# Altium schematic sheet CanFaults.SchDoc
size Letter; Organization: Altium Limited; Address1: L3, 12a Rodborough Rd; Address2: Frenchs Forest; Address3: NSW; Address4: Australia 2086; DocumentNumber: D_3; SheetNumber: 3; SheetTotal: 21
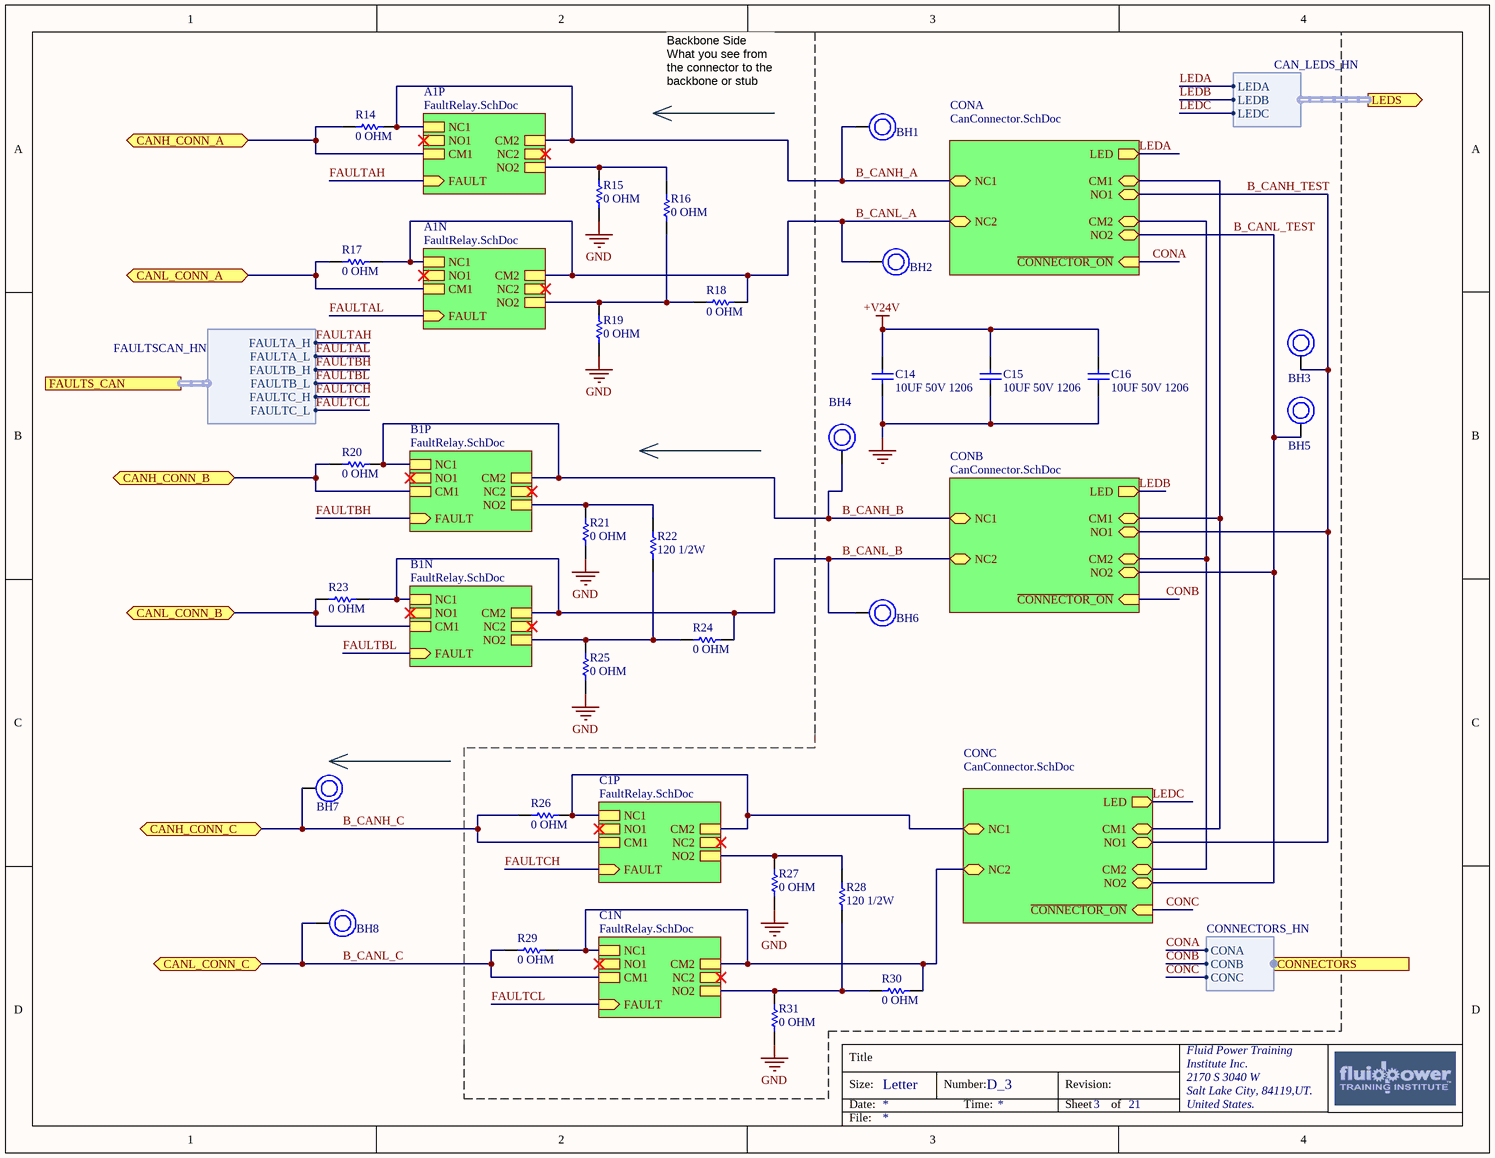
[diagram p0: CanFaults.SchDoc]

## Parts
BH1  BananaHole  [BananaHole]  (value not drawn)  (no BOM)
BH2  BananaHole  [BananaHole]  (value not drawn)  (no BOM)
BH3  BananaHole  [BananaHole]  (value not drawn)  (no BOM)
BH4  BananaHole  [BananaHole]  (value not drawn)  (no BOM)
BH5  BananaHole  [BananaHole]  (value not drawn)  (no BOM)
BH6  BananaHole  [BananaHole]  (value not drawn)  (no BOM)
BH7  BananaHole  [BananaHole]  (value not drawn)  (no BOM)
BH8  BananaHole  [BananaHole]  (value not drawn)  (no BOM)
C14  10UF 50V 1206  [CAPC3216X180X20ML20]
C15  10UF 50V 1206  [CAPC3216X180X20ML20]
C16  10UF 50V 1206  [CAPC3216X180X20ML20]
R14  0 OHM  [R0805]
R15  0 OHM  [R0805]
R16  0 OHM  [R0805]
R17  0 OHM  [R0805]
R18  0 OHM  [R0805]
R19  0 OHM  [R0805]
R20  0 OHM  [R0805]
R21  0 OHM  [R0805]
R22  120 1/2W  [RESC3225X60X45NL20T20]
R23  0 OHM  [R0805]
R24  0 OHM  [R0805]
R25  0 OHM  [R0805]
R26  0 OHM  [R0805]
R27  0 OHM  [R0805]
R28  120 1/2W  [RESC3225X60X45NL20T20]
R29  0 OHM  [R0805]
R30  0 OHM  [R0805]
R31  0 OHM  [R0805]

## Sub-sheets
A1N = FaultRelay.SchDoc: NC2, NO1, NC1, FAULT (in), NO2, CM1, CM2
A1P = FaultRelay.SchDoc: NC2, NO1, NC1, FAULT (in), NO2, CM1, CM2
B1N = FaultRelay.SchDoc: NC2, NO1, NC1, FAULT (in), NO2, CM1, CM2
B1P = FaultRelay.SchDoc: NC2, NO1, NC1, FAULT (in), NO2, CM1, CM2
C1N = FaultRelay.SchDoc: NC2, NO1, NC1, FAULT (in), NO2, CM1, CM2
C1P = FaultRelay.SchDoc: NC2, NO1, NC1, FAULT (in), NO2, CM1, CM2
CONA = CanConnector.SchDoc: CM2 (bidir), CM1 (bidir), NO2 (bidir), NO1 (bidir), NC2 (bidir), NC1 (bidir), ~{CONNECTOR_ON} (in), LED (out)
CONB = CanConnector.SchDoc: CM2 (bidir), CM1 (bidir), NO2 (bidir), NO1 (bidir), NC2 (bidir), NC1 (bidir), ~{CONNECTOR_ON} (in), LED (out)
CONC = CanConnector.SchDoc: CM2 (bidir), CM1 (bidir), NO2 (bidir), NO1 (bidir), NC2 (bidir), NC1 (bidir), ~{CONNECTOR_ON} (in), LED (out)

## Ports
CANH_CONN_A (bidir), CANH_CONN_B (bidir), CANH_CONN_C (bidir), CANL_CONN_A (bidir), CANL_CONN_B (bidir), CANL_CONN_C (bidir), CONNECTORS (harness CONNECTORS_HN), FAULTS_CAN (harness FAULTSCAN_HN), LEDS (out, harness CAN_LEDS_HN)

## Harnesses
FAULTSCAN_HN: FAULTA_H, FAULTA_L, FAULTB_H, FAULTB_L, FAULTC_H, FAULTC_L
CONNECTORS_HN: CONA, CONB, CONC
CAN_LEDS_HN: LEDA, LEDB, LEDC

## Nets
+V24V: C14.2 C15.2 C16.2
GND: C14.1 C15.1 C16.1 R15.1 R19.1 R21.1 R25.1 R27.1 R31.1
B_CANH_A: BH1.1 R14.2 ; sheet A1P/NC1, sheet A1P/CM2, sheet CONA/NC1
B_CANH_B: BH4.1 R20.2 ; sheet B1P/NC1, sheet B1P/CM2, sheet CONB/NC1
B_CANH_C: BH7.1 R26.1 ; port CANH_CONN_C, sheet C1P/CM1
B_CANH_TEST: BH3.1 ; sheet CONA/NO1, sheet CONB/NO1, sheet CONC/NO1
B_CANL_A: BH2.1 R17.2 R18.1 ; sheet A1N/NC1, sheet A1N/CM2, sheet CONA/NC2
B_CANL_B: BH6.1 R23.2 R24.1 ; sheet B1N/NC1, sheet B1N/CM2, sheet CONB/NC2
B_CANL_C: BH8.1 R29.1 ; port CANL_CONN_C, sheet C1N/CM1
B_CANL_TEST: BH5.1 ; sheet CONA/NO2, sheet CONB/NO2, sheet CONC/NO2
CANH_CONN_A: R14.1 ; port CANH_CONN_A, sheet A1P/CM1
CANH_CONN_B: R20.1 ; port CANH_CONN_B, sheet B1P/CM1
CANL_CONN_A: R17.1 ; port CANL_CONN_A, sheet A1N/CM1
CANL_CONN_B: R23.1 ; port CANL_CONN_B, sheet B1N/CM1
CONA: sheet CONA/~{CONNECTOR_ON}, port CONNECTORS.CONA
CONB: sheet CONB/~{CONNECTOR_ON}, port CONNECTORS.CONB
CONC: sheet CONC/~{CONNECTOR_ON}, port CONNECTORS.CONC
FAULTAH: sheet A1P/FAULT, port FAULTS_CAN.FAULTA_H
FAULTAL: sheet A1N/FAULT, port FAULTS_CAN.FAULTA_L
FAULTBH: sheet B1P/FAULT, port FAULTS_CAN.FAULTB_H
FAULTBL: sheet B1N/FAULT, port FAULTS_CAN.FAULTB_L
FAULTCH: sheet C1P/FAULT, port FAULTS_CAN.FAULTC_H
FAULTCL: sheet C1N/FAULT, port FAULTS_CAN.FAULTC_L
LEDA: sheet CONA/LED, port LEDS.LEDA
LEDB: sheet CONB/LED, port LEDS.LEDB
LEDC: sheet CONC/LED, port LEDS.LEDC
NetR15_2: R15.2 R16.2 ; sheet A1P/NO2
NetR16_1: R16.1 R18.2 R19.2 ; sheet A1N/NO2
NetR21_2: R21.2 R22.2 ; sheet B1P/NO2
NetR22_1: R22.1 R24.2 R25.2 ; sheet B1N/NO2
NetR26_2: R26.2 ; sheet C1P/NC1, sheet C1P/CM2, sheet CONC/NC1
NetR27_2: R27.2 R28.2 ; sheet C1P/NO2
NetR28_1: R28.1 R30.2 R31.2 ; sheet C1N/NO2
NetR29_2: R29.2 R30.1 ; sheet C1N/NC1, sheet C1N/CM2, sheet CONC/NC2
(unnamed): sheet CONA/CM2, sheet CONB/CM2, sheet CONC/CM2
(unnamed): sheet CONA/CM1, sheet CONB/CM1, sheet CONC/CM1

## Notes on the sheet
- Backbone Side
  What you see from the connector to the backbone or stub
- Title
- Size:
- Date:
- Letter
- Number:
- Time:
- Revision:
- Sheet
- of
- Fluid Power Training
- Institute Inc.
- 2170 S 3040 W
- Salt Lake City, 84119,UT.
- United States.
- File:

## Library data of the parts
BH1-BH8 = BananaHole: Banana hole for panel testing and board mounting
C14-C16 = C3216X5R1H106K160AB: CAP CER 10UF 50V X5R 1206; Manufacturer: TDK; Dielectric Material: Ceramic; Tolerance: 10%; Supplier 1: Mouser; Supplier Part Number 1: 810-C3216X5R1H106K; Manufacturer Part Number: C3216X5R1H106K160AB; RoHS: Yes; Category: Ceramic Capacitors; Stock 1: 145018; Pricing 1: 1=0.88000, 10=0.73100, 100=0.51800, 500=0.40900, 1000=0.35200, 2000=0.28700 (USD); Mount: Surface Mount; Case/Package: 1206; Weight: 0.000571oz; Case Code (Metric): 3216; Case Code (Imperial): 1206; Min Operating Temperature: -55°C; Max Operating Temperature: 85°C; Packaging: Tape and Reel; Capacitance: 10uF; Voltage Rating (DC): 50V; Dielectric: X5R; Package Quantity: 1; Voltage Rating: 50V; Termination: SMD/SMT; Voltage: 50V; Composition: Ceramic; Length: 3.2mm; Height: 1.6mm; Width: 0.063inch; Thickness: 0.071inch; Depth: 1.6mm; Radiation Hardening: No; REACH SVHC: No SVHC; Lead Free: Lead Free; ComponentLink1URL: https://datasheet.ciiva.com/24216/c3216x5r1h106k160ab-265364-24216574.pdf?src-supplier=Mouser; ComponentLink1Description: https://datasheet.ciiva.com/24216/c3216x5r1h106k160ab-265364-24216574.pdf?src-supplier=Mouser; ComponentLink2URL: https://datasheet.ciiva.com/6285/tdkmlcccaprange-6285895.pdf?src-supplier=Digi-Key; ComponentLink2Description: https://datasheet.ciiva.com/6285/tdkmlcccaprange-6285895.pdf?src-supplier=Digi-Key; ComponentLink3URL: https://datasheet.ciiva.com/24365/1865c3216x5r1h106k160ab-24365495.pdf?src-supplier=Onlinecomponents.com; ComponentLink3Description: https://datasheet.ciiva.com/24365/1865c3216x5r1h106k160ab-24365495.pdf?src-supplier=Onlinecomponents.com; ComponentLink4URL: https://datasheet.ciiva.com/22719/1796654-22719560.pdf?src-supplier=Element14; ComponentLink4Description: https://datasheet.ciiva.com/22719/1796654-22719560.pdf?src-supplier=Element14; ComponentLink5URL: https://datasheet.ciiva.com/28659/mlcc-commercial-general-en-28659437.pdf?src-supplier=Element14; ComponentLink5Description: https://datasheet.ciiva.com/28659/mlcc-commercial-general-en-28659437.pdf?src-supplier=Element14; ComponentLink6URL: https://datasheet.ciiva.com/17487/e412-c-17487294.pdf?src-supplier=Avnet+Europe; ComponentLink6Description: https://datasheet.ciiva.com/17487/e412-c-17487294.pdf?src-supplier=Avnet+Europe; ComponentLink7URL: https://datasheet.ciiva.com/6285/tdkmlcccaprange-6285893.pdf?src-supplier=Digi-Key; ComponentLink7Description: https://datasheet.ciiva.com/6285/tdkmlcccaprange-6285893.pdf?src-supplier=Digi-Key; ComponentLink8URL: https://datasheet.ciiva.com/22725/1913358-22725589.pdf?src-supplier=Element14; ComponentLink8Description: https://datasheet.ciiva.com/22725/1913358-22725589.pdf?src-supplier=Element14; ComponentLink9URL: https://datasheet.ciiva.com/23803/1796654-23803045.pdf?src-supplier=Newark; ComponentLink9Description: https://datasheet.ciiva.com/23803/1796654-23803045.pdf?src-supplier=Newark; ComponentLink10URL: https://datasheet.ciiva.com/28452/1796654-28452010.pdf?src-supplier=Element14; ComponentLink10Description: https://datasheet.ciiva.com/28452/1796654-28452010.pdf?src-supplier=Element14
R14 R15 R17-R21 R23-R27 R29-R31 = RK73Z2ATTD: Res Thick Film 0805 0 Ohm Pad SMD Automotive T/R; Manufacturer: KOA Speer; Resistance: 0mR; Tolerance: 1%; Power Rating: 2W; Temperature Coefficient: 400ppm/°C; Supplier 1: Mouser; Supplier Part Number 1: 660-RK73Z2ATTD; Manufacturer Part Number: RK73Z2ATTD; RoHS: Yes; Category: Chip SMD Resistors; Stock 1: 381276; Pricing 1: 1=0.10000, 10=0.09500, 100=0.09500, 1000=0.09500, 5000=0.00500, 10000=0.00400 (USD); Case/Package: 0805; Case Code (Imperial): 0805; Case Code (Metric): 2012; Min Operating Temperature: -55°C; Max Operating Temperature: 155°C; Packaging: Tape and Reel; Composition: Thick Film; Package Quantity: 5000; Termination: SMD/SMT; Military Standard: Not; Length: 2mm; Height: 0.5mm; Width: 1.25mm; Depth: 1.25mm; Lead Free: Lead Free; REACH SVHC: Unknown; ComponentLink1URL: https://datasheet.ciiva.com/7816/549012-7816885.pdf?src-supplier=Element14; ComponentLink1Description: https://datasheet.ciiva.com/7816/549012-7816885.pdf?src-supplier=Element14; ComponentLink2URL: https://datasheet.ciiva.com/15159/getdatasheetpartid-91633-15159914.pdf?src-supplier=Verical; ComponentLink2Description: https://datasheet.ciiva.com/15159/getdatasheetpartid-91633-15159914.pdf?src-supplier=Verical; ComponentLink3URL: https://datasheet.ciiva.com/48463/rk73z-series-eng-jap-tds-48463436.pdf?src-supplier=Distrelec; ComponentLink3Description: https://datasheet.ciiva.com/48463/rk73z-series-eng-jap-tds-48463436.pdf?src-supplier=Distrelec
R16 = RK73Z2ATTD: Res Thick Film 0805 0 Ohm Pad SMD Automotive T/R; Manufacturer: KOA Speer; Resistance: 0mR; Tolerance: 1%; Temperature Coefficient: 400ppm/°C; Power Rating: 2W; Supplier 1: Mouser; Supplier Part Number 1: 660-RK73Z2ATTD; Manufacturer Part Number: RK73Z2ATTD; RoHS: Yes; Category: Chip SMD Resistors; Stock 1: 381276; Pricing 1: 1=0.10000, 10=0.09500, 100=0.09500, 1000=0.09500, 5000=0.00500, 10000=0.00400 (USD); Case/Package: 0805; Case Code (Metric): 2012; Case Code (Imperial): 0805; Min Operating Temperature: -55°C; Max Operating Temperature: 155°C; Packaging: Tape and Reel; Package Quantity: 5000; Composition: Thick Film; Termination: SMD/SMT; Military Standard: Not; Length: 2mm; Height: 0.5mm; Width: 1.25mm; Depth: 1.25mm; Lead Free: Lead Free; REACH SVHC: Unknown; ComponentLink1URL: https://datasheet.ciiva.com/7816/549012-7816885.pdf?src-supplier=Element14; ComponentLink1Description: https://datasheet.ciiva.com/7816/549012-7816885.pdf?src-supplier=Element14; ComponentLink2URL: https://datasheet.ciiva.com/15159/getdatasheetpartid-91633-15159914.pdf?src-supplier=Verical; ComponentLink2Description: https://datasheet.ciiva.com/15159/getdatasheetpartid-91633-15159914.pdf?src-supplier=Verical; ComponentLink3URL: https://datasheet.ciiva.com/48463/rk73z-series-eng-jap-tds-48463436.pdf?src-supplier=Distrelec; ComponentLink3Description: https://datasheet.ciiva.com/48463/rk73z-series-eng-jap-tds-48463436.pdf?src-supplier=Distrelec
R22 R28 = CRCW1210120RFKEA: Thick Film Resistors - SMD 1/2watt 120ohms 1%; Manufacturer: Vishay; Resistance: 120R; Temperature Coefficient: 100ppm/°C; Power Rating: 500mW; Voltage Rating: 200V; Supplier 1: Mouser; Supplier Part Number 1: 71-CRCW1210F-120-E3; Manufacturer Part Number: CRCW1210120RFKEA; RoHS: Yes; Category: Chip SMD Resistors; Stock 1: 16273; Pricing 1: 1=0.25000, 10=0.21500, 100=0.08400, 1000=0.03200, 5000=0.02600, 10000=0.02400 (USD); Case/Package: 1210; Weight: 0.000564oz; Case Code (Metric): 3225; Case Code (Imperial): 1210; Contact Plating: Tin; Min Operating Temperature: -55°C; Max Operating Temperature: 155°C; Tolerance: 1%; Packaging: Tape and Reel; Package Quantity: 1; Composition: Thick Film; Voltage Rating (DC): 200V; Number of Terminations: 2; Max Power Dissipation: 500mW; Termination: SMD/SMT; Military Standard: Not; Features: Automotive AEC-Q200; Length: 3.2mm; Height: 0.024inch; Width: 0.098inch; Depth: 2.5mm; Radiation Hardening: No; Lead Free: Lead Free; REACH SVHC: Unknown; ComponentLink1URL: https://datasheet.ciiva.com/8899/dcrcwe3-8899640.pdf?src-supplier=Avnet; ComponentLink1Description: https://datasheet.ciiva.com/8899/dcrcwe3-8899640.pdf?src-supplier=Avnet; ComponentLink2URL: https://datasheet.ciiva.com/7777/1697337-7777595.pdf?src-supplier=Element14; ComponentLink2Description: https://datasheet.ciiva.com/7777/1697337-7777595.pdf?src-supplier=Element14; ComponentLink3URL: https://datasheet.ciiva.com/8897/dcrcwe3-8897165.pdf?src-supplier=Avnet; ComponentLink3Description: https://datasheet.ciiva.com/8897/dcrcwe3-8897165.pdf?src-supplier=Avnet; ComponentLink4URL: https://datasheet.ciiva.com/5549/dcrcwe3-109170-5549774.pdf?src-supplier=Mouser; ComponentLink4Description: https://datasheet.ciiva.com/5549/dcrcwe3-109170-5549774.pdf?src-supplier=Mouser